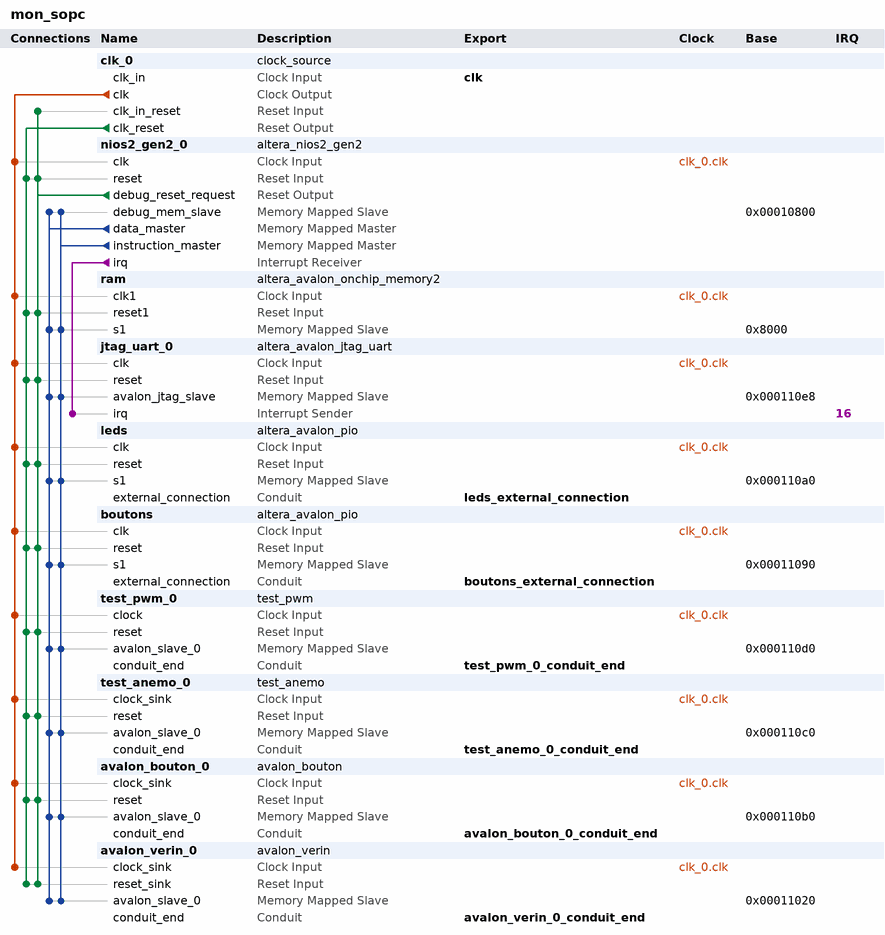
[diagram p0: system contents]
# Platform Designer (Qsys) system mon_sopc, Cyclone IV E EP4CE22F17C6
# Parameters at their usual value, and those the tool derives, are not listed.
package require -exact qsys 18.1
create_system mon_sopc
set_project_property DEVICE_FAMILY {Cyclone IV E}
set_project_property DEVICE EP4CE22F17C6

add_instance clk_0 clock_source 18.1
set_instance_parameter_value clk_0 clockFrequency 50000000

add_instance nios2_gen2_0 altera_nios2_gen2 18.1
set_instance_parameter_value nios2_gen2_0 dcache_size 2048
set_instance_parameter_value nios2_gen2_0 exceptionSlave ram.s1
set_instance_parameter_value nios2_gen2_0 icache_size 4096
set_instance_parameter_value nios2_gen2_0 impl Tiny
set_instance_parameter_value nios2_gen2_0 resetSlave ram.s1

add_instance ram altera_avalon_onchip_memory2 18.1
set_instance_parameter_value ram dataWidth 32
set_instance_parameter_value ram dualPort false
set_instance_parameter_value ram initMemContent true
set_instance_parameter_value ram initializationFileName onchip_mem.hex
set_instance_parameter_value ram memorySize 20480

add_instance jtag_uart_0 altera_avalon_jtag_uart 18.1
set_instance_parameter_value jtag_uart_0 simInteractiveOptions NO_INTERACTIVE_WINDOWS

add_instance leds altera_avalon_pio 18.1
set_instance_parameter_value leds direction Output
set_instance_parameter_value leds width 8

add_instance boutons altera_avalon_pio 18.1
set_instance_parameter_value boutons direction Input
set_instance_parameter_value boutons width 2

add_instance test_pwm_0 test_pwm 1.0

add_instance test_anemo_0 test_anemo 1.0

add_instance avalon_bouton_0 avalon_bouton 1.0

add_instance avalon_verin_0 avalon_verin 1.0

# connections
add_connection clk_0.clk avalon_bouton_0.clock_sink clock
add_connection clk_0.clk avalon_verin_0.clock_sink clock
add_connection clk_0.clk boutons.clk clock
add_connection clk_0.clk jtag_uart_0.clk clock
add_connection clk_0.clk leds.clk clock
add_connection clk_0.clk nios2_gen2_0.clk clock
add_connection clk_0.clk ram.clk1 clock
add_connection clk_0.clk test_anemo_0.clock_sink clock
add_connection clk_0.clk test_pwm_0.clock clock
add_connection clk_0.clk_reset avalon_bouton_0.reset reset
add_connection clk_0.clk_reset avalon_verin_0.reset_sink reset
add_connection clk_0.clk_reset boutons.reset reset
add_connection clk_0.clk_reset jtag_uart_0.reset reset
add_connection clk_0.clk_reset leds.reset reset
add_connection clk_0.clk_reset nios2_gen2_0.reset reset
add_connection clk_0.clk_reset ram.reset1 reset
add_connection clk_0.clk_reset test_anemo_0.reset reset
add_connection clk_0.clk_reset test_pwm_0.reset reset
add_connection nios2_gen2_0.debug_reset_request avalon_bouton_0.reset reset
add_connection nios2_gen2_0.debug_reset_request avalon_verin_0.reset_sink reset
add_connection nios2_gen2_0.debug_reset_request boutons.reset reset
add_connection nios2_gen2_0.debug_reset_request clk_0.clk_in_reset reset
add_connection nios2_gen2_0.debug_reset_request jtag_uart_0.reset reset
add_connection nios2_gen2_0.debug_reset_request leds.reset reset
add_connection nios2_gen2_0.debug_reset_request nios2_gen2_0.reset reset
add_connection nios2_gen2_0.debug_reset_request ram.reset1 reset
add_connection nios2_gen2_0.debug_reset_request test_anemo_0.reset reset
add_connection nios2_gen2_0.debug_reset_request test_pwm_0.reset reset
add_connection nios2_gen2_0.data_master avalon_bouton_0.avalon_slave_0 avalon
set_connection_parameter_value nios2_gen2_0.data_master/avalon_bouton_0.avalon_slave_0 baseAddress 0x000110b0
add_connection nios2_gen2_0.data_master avalon_verin_0.avalon_slave_0 avalon
set_connection_parameter_value nios2_gen2_0.data_master/avalon_verin_0.avalon_slave_0 baseAddress 0x00011020
add_connection nios2_gen2_0.data_master boutons.s1 avalon
set_connection_parameter_value nios2_gen2_0.data_master/boutons.s1 baseAddress 0x00011090
add_connection nios2_gen2_0.data_master jtag_uart_0.avalon_jtag_slave avalon
set_connection_parameter_value nios2_gen2_0.data_master/jtag_uart_0.avalon_jtag_slave baseAddress 0x000110e8
add_connection nios2_gen2_0.data_master leds.s1 avalon
set_connection_parameter_value nios2_gen2_0.data_master/leds.s1 baseAddress 0x000110a0
add_connection nios2_gen2_0.data_master nios2_gen2_0.debug_mem_slave avalon
set_connection_parameter_value nios2_gen2_0.data_master/nios2_gen2_0.debug_mem_slave baseAddress 0x00010800
add_connection nios2_gen2_0.data_master ram.s1 avalon
set_connection_parameter_value nios2_gen2_0.data_master/ram.s1 baseAddress 0x8000
add_connection nios2_gen2_0.data_master test_anemo_0.avalon_slave_0 avalon
set_connection_parameter_value nios2_gen2_0.data_master/test_anemo_0.avalon_slave_0 baseAddress 0x000110c0
add_connection nios2_gen2_0.data_master test_pwm_0.avalon_slave_0 avalon
set_connection_parameter_value nios2_gen2_0.data_master/test_pwm_0.avalon_slave_0 baseAddress 0x000110d0
add_connection nios2_gen2_0.instruction_master avalon_bouton_0.avalon_slave_0 avalon
set_connection_parameter_value nios2_gen2_0.instruction_master/avalon_bouton_0.avalon_slave_0 baseAddress 0x000110b0
add_connection nios2_gen2_0.instruction_master avalon_verin_0.avalon_slave_0 avalon
set_connection_parameter_value nios2_gen2_0.instruction_master/avalon_verin_0.avalon_slave_0 baseAddress 0x00011020
add_connection nios2_gen2_0.instruction_master boutons.s1 avalon
set_connection_parameter_value nios2_gen2_0.instruction_master/boutons.s1 baseAddress 0x00011090
add_connection nios2_gen2_0.instruction_master jtag_uart_0.avalon_jtag_slave avalon
set_connection_parameter_value nios2_gen2_0.instruction_master/jtag_uart_0.avalon_jtag_slave baseAddress 0x000110e8
add_connection nios2_gen2_0.instruction_master leds.s1 avalon
set_connection_parameter_value nios2_gen2_0.instruction_master/leds.s1 baseAddress 0x000110a0
add_connection nios2_gen2_0.instruction_master nios2_gen2_0.debug_mem_slave avalon
set_connection_parameter_value nios2_gen2_0.instruction_master/nios2_gen2_0.debug_mem_slave baseAddress 0x00010800
add_connection nios2_gen2_0.instruction_master ram.s1 avalon
set_connection_parameter_value nios2_gen2_0.instruction_master/ram.s1 baseAddress 0x8000
add_connection nios2_gen2_0.instruction_master test_anemo_0.avalon_slave_0 avalon
set_connection_parameter_value nios2_gen2_0.instruction_master/test_anemo_0.avalon_slave_0 baseAddress 0x000110c0
add_connection nios2_gen2_0.instruction_master test_pwm_0.avalon_slave_0 avalon
set_connection_parameter_value nios2_gen2_0.instruction_master/test_pwm_0.avalon_slave_0 baseAddress 0x000110d0
add_connection nios2_gen2_0.irq jtag_uart_0.irq interrupt
set_connection_parameter_value nios2_gen2_0.irq/jtag_uart_0.irq irqNumber 16

# exported interfaces
add_interface avalon_bouton_0_conduit_end conduit end
set_interface_property avalon_bouton_0_conduit_end EXPORT_OF avalon_bouton_0.conduit_end
add_interface avalon_verin_0_conduit_end conduit end
set_interface_property avalon_verin_0_conduit_end EXPORT_OF avalon_verin_0.conduit_end
add_interface boutons_external_connection conduit end
set_interface_property boutons_external_connection EXPORT_OF boutons.external_connection
add_interface clk clock sink
set_interface_property clk EXPORT_OF clk_0.clk_in
add_interface leds_external_connection conduit end
set_interface_property leds_external_connection EXPORT_OF leds.external_connection
add_interface test_anemo_0_conduit_end conduit end
set_interface_property test_anemo_0_conduit_end EXPORT_OF test_anemo_0.conduit_end
add_interface test_pwm_0_conduit_end conduit end
set_interface_property test_pwm_0_conduit_end EXPORT_OF test_pwm_0.conduit_end

set_interconnect_requirement {$system} qsys_mm.clockCrossingAdapter HANDSHAKE
set_interconnect_requirement {$system} qsys_mm.enableEccProtection FALSE
set_interconnect_requirement {$system} qsys_mm.insertDefaultSlave FALSE
set_interconnect_requirement {$system} qsys_mm.maxAdditionalLatency 1

save_system mon_sopc.qsys
